# Altium schematic sheet STM32.SchDoc
size A3
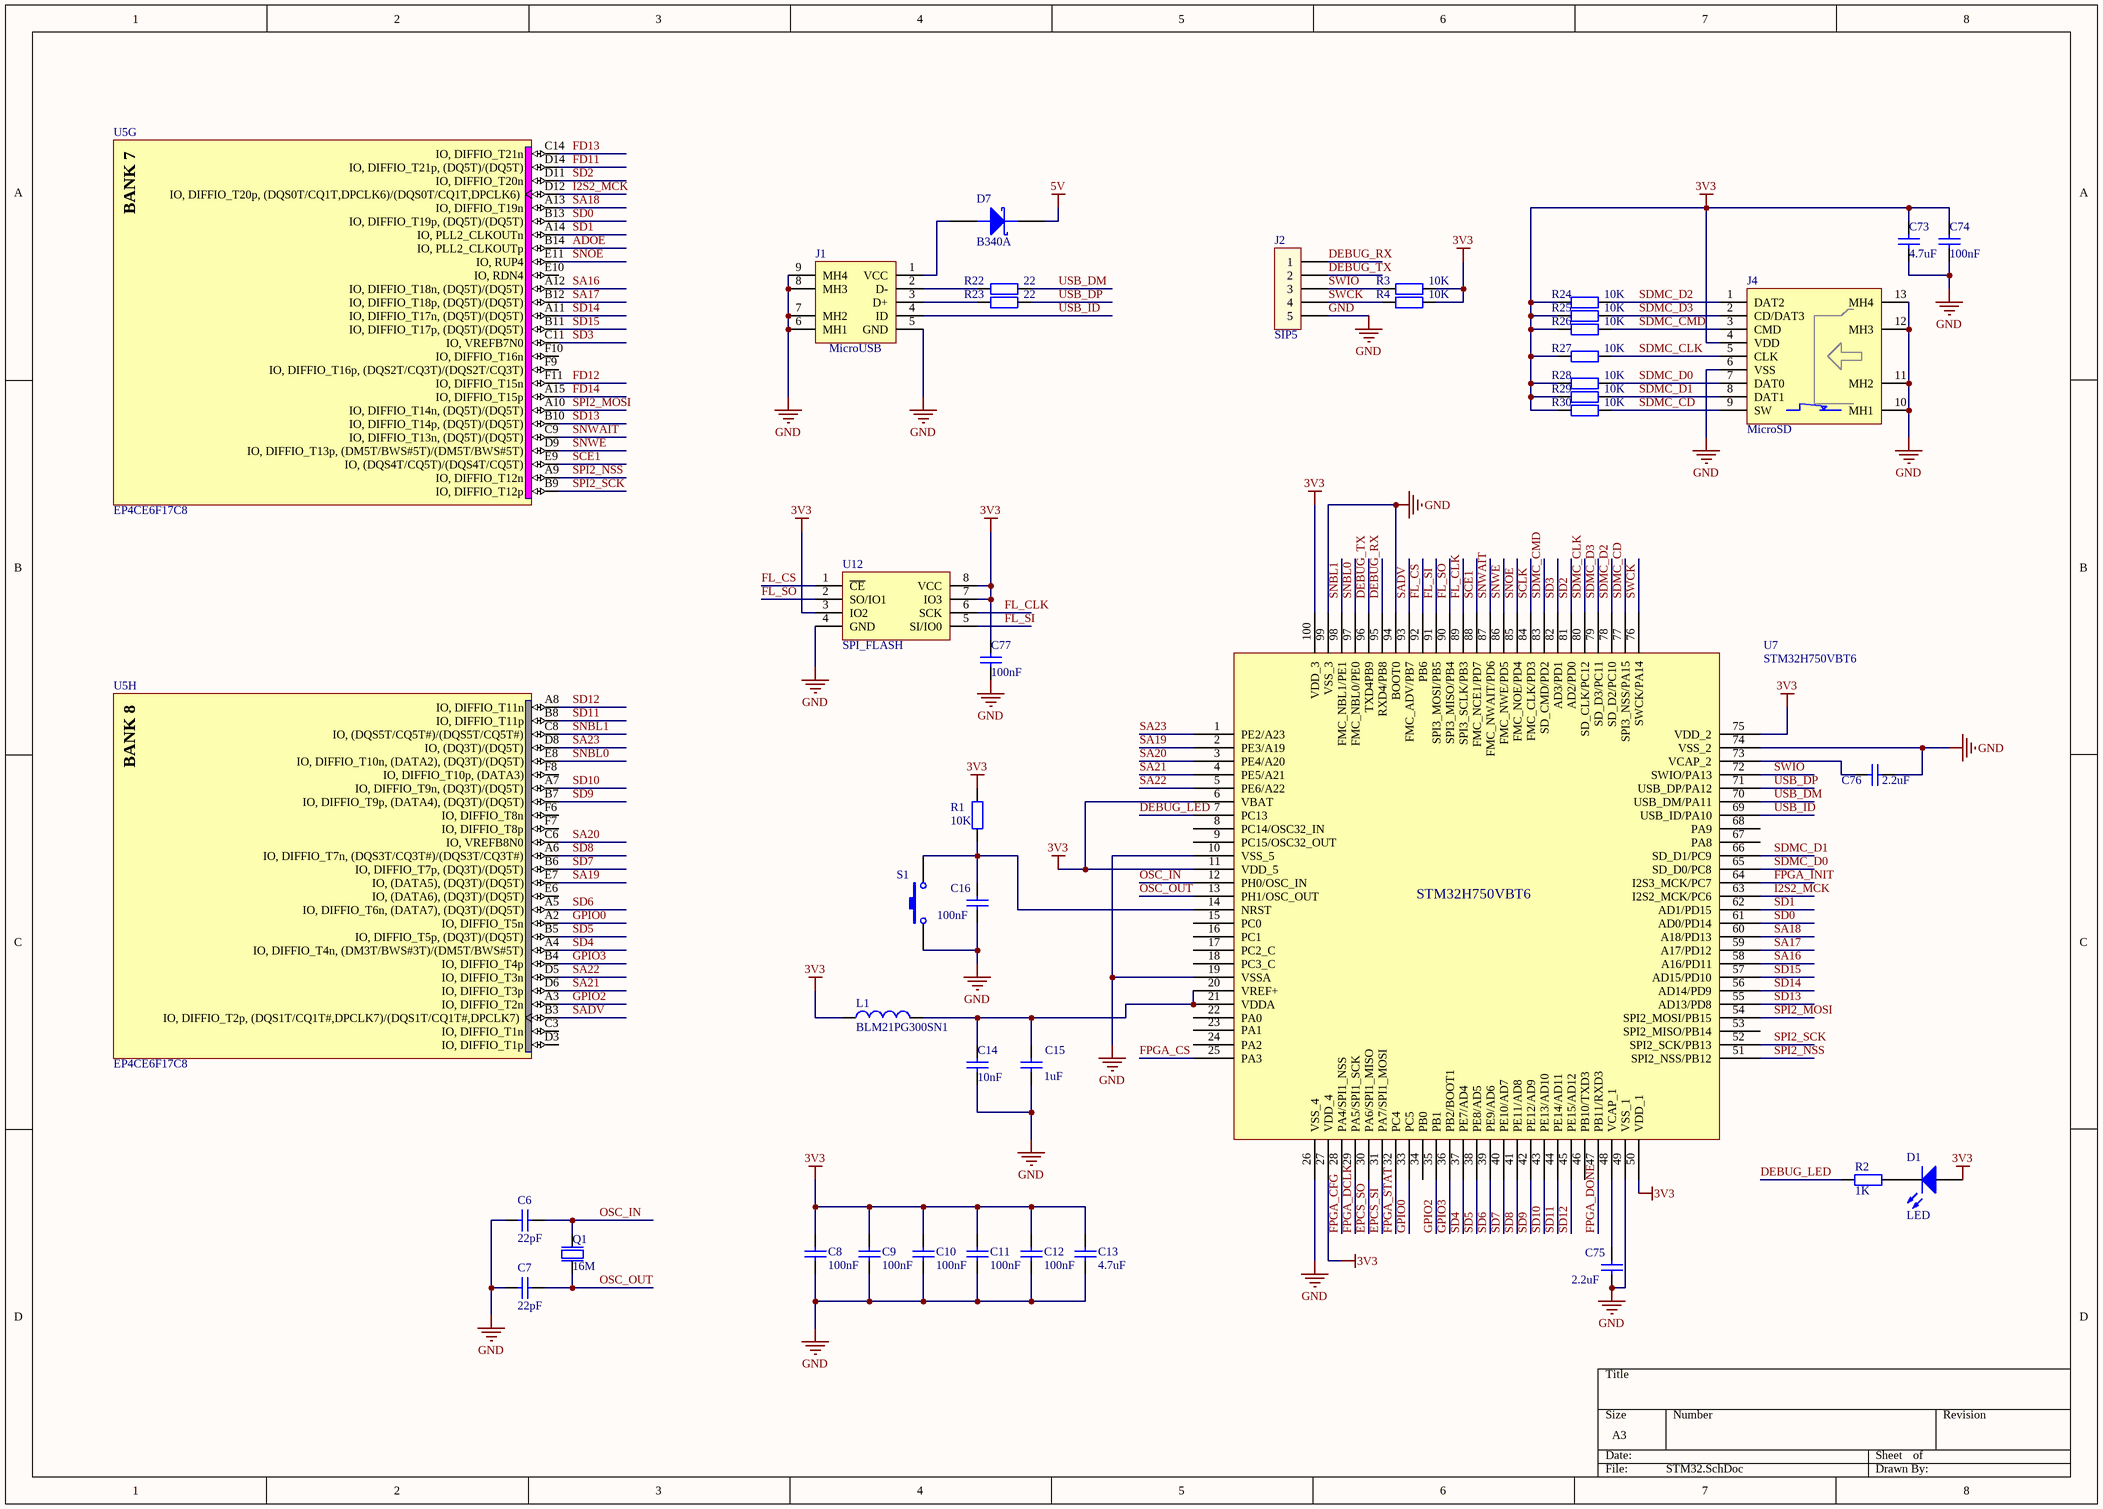
[diagram p0: STM32.SchDoc]

## Parts
C6  22pF  [C0603]
C7  22pF  [C0603]
C8  100nF  [C0603]
C9  100nF  [C0603]
C10  100nF  [C0603]
C11  100nF  [C0603]
C12  100nF  [C0603]
C13  4.7uF  [C0603]
C14  10nF  [C0603]
C15  1uF  [C0603]
C16  100nF  [C0603]
C73  4.7uF  [C0603]
C74  100nF  [C0603]
C75  2.2uF  [C0603]
C76  2.2uF  [C0603]
C77  100nF  [C0603]
D1  LED  [D0603]
D7  B340A  [SMA]
J1  MicroUSB  [USB_MICRO_5S_B]
J2  SIP5  [SIP5]
J4  MicroSD  [MicroSD-1]
L1  BLM21PG300SN1  [R0805]
Q1  16M  [SMD3225]
R1  10K  [R0603]
R2  1K  [R0603]
R3  10K  [R0603]
R4  10K  [R0603]
R22  22  [R0603]
R23  22  [R0603]
R24  10K  [R0603]
R25  10K  [R0603]
R26  10K  [R0603]
R27  10K  [R0603]
R28  10K  [R0603]
R29  10K  [R0603]
R30  10K  [R0603]
S1  SW-PB  [SW4_5X5]  (value not drawn)
U5  EP4CE6F17C8  [FBGA256]  (parts G,H of 13)
U7  STM32H750VBT6  [TQFP-100]
U12  SPI_FLASH  [SOIC-8]

## Nets
3V3: C8.2 C9.2 C10.2 C11.2 C12.2 C13.2 C73.2 C74.2 C77.2 D1.1 J4.4(VDD) L1.1 R1.2 R3.2 R4.2 R24.1 R25.1 R26.1 R27.1 R28.1 R29.1 R30.1 U7.6(VBAT) U7.11(VDD_5) U7.27(VDD_4) U7.50(VDD_1) U7.75(VDD_2) U7.100(VDD_3) U12.3(IO2) U12.7(IO3) U12.8(VCC)
5V: D7.2(K)
GND: C6.2 C7.2 C8.1 C9.1 C10.1 C11.1 C12.1 C13.1 C14.1 C15.1 C16.2 C73.1 C74.1 C75.1 C76.1 C77.1 J1.5(GND) J1.6(MH1) J1.7(MH2) J1.8(MH3) J1.9(MH4) J2.5 J4.6(VSS) J4.10(MH1) J4.11(MH2) J4.12(MH3) J4.13(MH4) Q1.2(GND) Q1.4(GND) S1.1 U7.10(VSS_5) U7.19(VSSA) U7.26(VSS_4) U7.49(VSS_1) U7.74(VSS_2) U7.94(BOOT0) U7.99(VSS_3) U12.4(GND)
ADOE: U5.B14(IO,_PLL2_CLKOUTp)
DEBUG_LED: R2.2 U7.7(PC13)
DEBUG_RX: J2.1 U7.95(RXD4/PB8)
DEBUG_TX: J2.2 U7.96(TXD4PB9)
EPCS_SI: U7.31(PA7/SPI1_MOSI)
EPCS_SO: U7.30(PA6/SPI1_MISO)
FD11: U5.D14(IO,_DIFFIO_T21p,_(DQ5T)/(DQ5T))
FD12: U5.F11(IO,_DIFFIO_T15n)
FD13: U5.C14(IO,_DIFFIO_T21n)
FD14: U5.A15(IO,_DIFFIO_T15p)
FL_CLK: U7.89(SPI3_SCLK/PB3) U12.6(SCK)
FL_CS: U7.92(PB6) U12.1(~{CE})
FL_SI: U7.91(SPI3_MOSI/PB5) U12.5(SI/IO0)
FL_SO: U7.90(SPI3_MISO/PB4) U12.2(SO/IO1)
FPGA_CFG: U7.28(PA4/SPI1_NSS)
FPGA_CS: U7.25(PA3)
FPGA_DCLK: U7.29(PA5/SPI1_SCK)
FPGA_DONE: U7.47(PB11/RXD3)
FPGA_INIT: U7.64(I2S3_MCK/PC7)
FPGA_STAT: U7.32(PC4)
GPIO0: U5.A2(IO,_DIFFIO_T5n) U7.33(PC5)
GPIO2: U5.A3(IO,_DIFFIO_T2n) U7.35(PB1)
GPIO3: U5.B4(IO,_DIFFIO_T4p) U7.36(PB2/BOOT1)
I2S2_MCK: U5.D12(IO,_DIFFIO_T20p,_(DQS0T/CQ1T,DPCLK6)/(DQS0T/CQ1T,DPCLK6)) U7.63(I2S2_MCK/PC6)
OSC_IN: C6.1 Q1.3(out) U7.12(PH0/OSC_IN)
OSC_OUT: C7.1 Q1.1(inp) U7.13(PH1/OSC_OUT)
SA16: U5.A12(IO,_DIFFIO_T18n,_(DQ5T)/(DQ5T)) U7.58(A16/PD11)
SA17: U5.B12(IO,_DIFFIO_T18p,_(DQ5T)/(DQ5T)) U7.59(A17/PD12)
SA18: U5.A13(IO,_DIFFIO_T19n) U7.60(A18/PD13)
SA19: U5.E7(IO,_(DATA5),_(DQ3T)/(DQ5T)) U7.2(PE3/A19)
SA20: U5.C6(IO,_VREFB8N0) U7.3(PE4/A20)
SA21: U5.D6(IO,_DIFFIO_T3p) U7.4(PE5/A21)
SA22: U5.D5(IO,_DIFFIO_T3n) U7.5(PE6/A22)
SA23: U5.D8(IO,_(DQ3T)/(DQ5T)) U7.1(PE2/A23)
SADV: U5.B3(IO,_DIFFIO_T2p,_(DQS1T/CQ1T#,DPCLK7)/(DQS1T/CQ1T#,DPCLK7)) U7.93(FMC_ADV/PB7)
SCE1: U5.E9(IO,_(DQS4T/CQ5T)/(DQS4T/CQ5T)) U7.88(FMC_NCE1/PD7)
SCLK: U7.84(FMC_CLK/PD3)
SD0: U5.B13(IO,_DIFFIO_T19p,_(DQ5T)/(DQ5T)) U7.61(AD0/PD14)
SD1: U5.A14(IO,_PLL2_CLKOUTn) U7.62(AD1/PD15)
SD2: U5.D11(IO,_DIFFIO_T20n) U7.81(AD2/PD0)
SD3: U5.C11(IO,_VREFB7N0) U7.82(AD3/PD1)
SD4: U5.A4(IO,_DIFFIO_T4n,_(DM3T/BWS#3T)/(DM5T/BWS#5T)) U7.37(PE7/AD4)
SD5: U5.B5(IO,_DIFFIO_T5p,_(DQ3T)/(DQ5T)) U7.38(PE8/AD5)
SD6: U5.A5(IO,_DIFFIO_T6n,_(DATA7),_(DQ3T)/(DQ5T)) U7.39(PE9/AD6)
SD7: U5.B6(IO,_DIFFIO_T7p,_(DQ3T)/(DQ5T)) U7.40(PE10/AD7)
SD8: U5.A6(IO,_DIFFIO_T7n,_(DQS3T/CQ3T#)/(DQS3T/CQ3T#)) U7.41(PE11/AD8)
SD9: U5.B7(IO,_DIFFIO_T9p,_(DATA4),_(DQ3T)/(DQ5T)) U7.42(PE12/AD9)
SD10: U5.A7(IO,_DIFFIO_T9n,_(DQ3T)/(DQ5T)) U7.43(PE13/AD10)
SD11: U5.B8(IO,_DIFFIO_T11p) U7.44(PE14/AD11)
SD12: U5.A8(IO,_DIFFIO_T11n) U7.45(PE15/AD12)
SD13: U5.B10(IO,_DIFFIO_T14p,_(DQ5T)/(DQ5T)) U7.55(AD13/PD8)
SD14: U5.A11(IO,_DIFFIO_T17n,_(DQ5T)/(DQ5T)) U7.56(AD14/PD9)
SD15: U5.B11(IO,_DIFFIO_T17p,_(DQ5T)/(DQ5T)) U7.57(AD15/PD10)
SDMC_CD: J4.9(SW) R30.2 U7.77(SPI3_NSS/PA15)
SDMC_CLK: J4.5(CLK) R27.2 U7.80(SD_CLK/PC12)
SDMC_CMD: J4.3(CMD) R26.2 U7.83(SD_CMD/PD2)
SDMC_D0: J4.7(DAT0) R28.2 U7.65(SD_D0/PC8)
SDMC_D1: J4.8(DAT1) R29.2 U7.66(SD_D1/PC9)
SDMC_D2: J4.1(DAT2) R24.2 U7.78(SD_D2/PC10)
SDMC_D3: J4.2(CD/DAT3) R25.2 U7.79(SD_D3/PC11)
SNBL0: U5.E8(IO,_DIFFIO_T10n,_(DATA2),_(DQ3T)/(DQ5T)) U7.97(FMC_NBL0/PE0)
SNBL1: U5.C8(IO,_(DQS5T/CQ5T#)/(DQS5T/CQ5T#)) U7.98(FMC_NBL1/PE1)
SNOE: U5.E11(IO,_RUP4) U7.85(FMC_NOE/PD4)
SNWAIT: U5.C9(IO,_DIFFIO_T13n,_(DQ5T)/(DQ5T)) U7.87(FMC_NWAIT/PD6)
SNWE: U5.D9(IO,_DIFFIO_T13p,_(DM5T/BWS#5T)/(DM5T/BWS#5T)) U7.86(FMC_NWE/PD5)
SPI2_MOSI: U5.A10(IO,_DIFFIO_T14n,_(DQ5T)/(DQ5T)) U7.54(SPI2_MOSI/PB15)
SPI2_NSS: U5.A9(IO,_DIFFIO_T12n) U7.51(SPI2_NSS/PB12)
SPI2_SCK: U5.B9(IO,_DIFFIO_T12p) U7.52(SPI2_SCK/PB13)
SWCK: J2.4 R4.1 U7.76(SWCK/PA14)
SWIO: J2.3 R3.1 U7.72(SWIO/PA13)
USB_DM: R22.2 U7.70(USB_DM/PA11)
USB_DP: R23.2 U7.71(USB_DP/PA12)
USB_ID: J1.4(ID) U7.69(USB_ID/PA10)
NetC14_2: C14.2 C15.2 L1.2 U7.20(VREF+) U7.21(VDDA)
NetC16_1: C16.1 R1.1 S1.2 U7.14(NRST)
NetC75_2: C75.2 U7.48(VCAP_1)
NetC76_2: C76.2 U7.73(VCAP_2)
NetD1_2: D1.2 R2.1
NetD7_1: D7.1(A) J1.1(VCC)
NetJ1_2: J1.2(D-) R22.1
NetJ1_3: J1.3(D+) R23.1

Not connected (* = marked no-connect by the designer): U5 C3(IO,_DIFFIO_T1n) D3(IO,_DIFFIO_T1p) E6(IO,_(DATA6),_(DQ3T)/(DQ5T)) E10(IO,_RDN4) F6(IO,_DIFFIO_T8n) F7(IO,_DIFFIO_T8p) F8(IO,_DIFFIO_T10p,_(DATA3)) F9(IO,_DIFFIO_T16p,_(DQS2T/CQ3T)/(DQS2T/CQ3T)) F10(IO,_DIFFIO_T16n); U7 8(PC14/OSC32_IN) 9(PC15/OSC32_OUT) 15(PC0) 16(PC1) 17(PC2_C) 18(PC3_C) 22(PA0) 23(PA1) 24(PA2) 34(PB0) 46(PB10/TXD3) 53(SPI2_MISO/PB14) 67(PA8) 68(PA9)

## Notes on the sheet
- (in symbol EP4CE6F17C8, part G) BANK 7
- (in symbol EP4CE6F17C8, part H) BANK 8

## Library data of the parts
C6-C16 C73-C77 = Cap: Capacitor; Published: 8-Jun-2000; LatestRevisionDate: 17-Jul-2002; LatestRevisionNote: Re-released for DXP Platform.; PackageReference: RAD-0.3; Publisher: Altium Limited
D1 = LED1: Typical RED GaAs LED; Published: 8-Jun-2000; LatestRevisionDate: 08-Jul-2005; LatestRevisionNote: Mech Layer 1 removed.; PackageReference: LED-1; Publisher: Altium Limited
D7 = DIODE SCHOTTKY: Schottky Diode
J1 = USB_Micro_5S_B: USB micro female SMT with 4 fixed foot
L1 = Inductor: Code_IEC: 1005; Published: 8-Jun-2000; LatestRevisionDate: 17-Jul-2002; LatestRevisionNote: Re-released for DXP Platform.; PackageReference: 0402-A; Publisher: Altium Limited; Code_JEITA: 0402
Q1 = XTAL_SMD2016_32MHz_8pF_General: XTAL SMD 2016, 32MHz, Cl=8pF, Total Tol: ±40ppm; Note: XTAL SMD 32.000MHz; Artikkelnr Noca: N.A.; Part Number: XTAL_SMD2016_32MHz_8pF_General; Manufacturer: *; Manufacturer Part Number: *; Datasheet: *; LatestRevisionDate: 2016-08-19; Pin Count: 4; Publisher: Nordic Semiconductor; Published: 2016-08-19; Value: 32MHz; Supplier: *; Supplier part number: *; 2nd source Supplier: *; 2nd source part number: *; Footprint Doc: XTAL_2016; Artikkelnr Simpro: N.A.
R1-R4 R22-R30 = Res2: Resistor; Published: 8-Jun-2000; LatestRevisionDate: 17-Jul-2002; LatestRevisionNote: Re-released for DXP Platform.; PackageReference: AXIAL-0.4; Publisher: Altium Limited
S1 = SW-PB: Switch; Published: 24-Mar-1999; LatestRevisionDate: 17-Jul-2002; LatestRevisionNote: Re-released for DXP Platform.; PackageReference: SPST-2; Publisher: Altium Limited
U5 = EP4CE6F17C8: Cyclone IV Family FPGA, 2V Core, 179 I/O Pins, 2 PLLs, 256-Pin FBGA, Speed Grade 8, Commercial Grade; Published: 3-May-2010; DatasheetVersion: ver1.2, Mar-2010; PackageVersion: ver16.0, Dec-2009; PackageReference: FBGA256; Publisher: Altium Limited; PackageDescription: 256-Ball FineLine Ball Grid Array (FBGA256) - Option 1 - Wire Bond; Code_JEDEC: MS-034-AAF-1; Code_IPC: BGA100P16X16-256; ComponentLink1Description: Manufacturer Link; ComponentLink1URL: http://www.altera.com/; ComponentLink2Description: Handbook; ComponentLink2URL: http://www.altera.com/literature/hb/cyclone-iv/cyclone4-handbook.pdf; ComponentLink3Description: Pinout Specification; ComponentLink3URL: http://www.altera.com/literature/lit-dp.jsp?category=cyc%204&showspreadsheet=y; ComponentLink4Description: Packaging Specification; ComponentLink4URL: http://www.altera.com/literature/ds/dspkg.pdf
U12 = SPIMEM